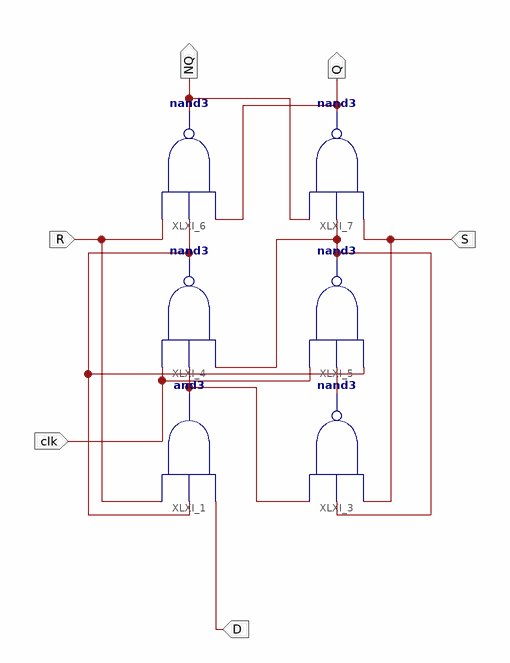
[diagram p0: schematic sheet 1]
// Xilinx ISE schematic D_flop_posedge.sch (spartan6) as structural Verilog: 6 symbols, 6 ports
module D_flop_posedge (
  input  R,
  input  D,
  input  S,
  input  clk,
  output Q,
  output NQ
);

  wire XLXN_7, XLXN_12, XLXN_25, XLXN_28;

  and XLXI_1 (XLXN_12, D, XLXN_25, R);
  nand XLXI_3 (XLXN_7, S, XLXN_28, XLXN_12);
  nand XLXI_4 (XLXN_25, XLXN_28, XLXN_12, clk);
  nand XLXI_5 (XLXN_28, XLXN_25, XLXN_7, clk);
  nand XLXI_6 (NQ, Q, XLXN_25, R);
  nand XLXI_7 (Q, S, XLXN_28, NQ);
endmodule
